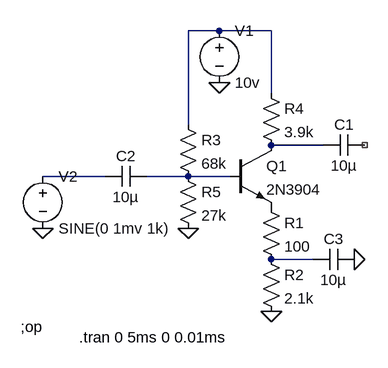
[diagram p0: schematic Az1.asc]
Az1.asc, the LTspice schematic file:
Version 4
SHEET 1 880 680
WIRE 112 -80 64 -80
WIRE 192 -80 112 -80
WIRE 192 16 192 -80
WIRE 64 64 64 -80
WIRE 272 96 192 96
WIRE -64 144 -160 144
WIRE 64 144 0 144
WIRE 128 144 64 144
WIRE 256 272 192 272
FLAG 64 224 0
FLAG 192 352 0
FLAG 112 0 0
FLAG -160 224 0
FLAG 320 272 0
SYMBOL npn 128 96 R0
SYMATTR InstName Q1
SYMATTR Value 2N3904
SYMBOL res 176 176 R0
SYMATTR InstName R1
SYMATTR Value 100
SYMBOL res 176 256 R0
SYMATTR InstName R2
SYMATTR Value 2.1k
SYMBOL res 48 48 R0
SYMATTR InstName R3
SYMATTR Value 68k
SYMBOL res 176 0 R0
SYMATTR InstName R4
SYMATTR Value 3.9k
SYMBOL res 48 128 R0
SYMATTR InstName R5
SYMATTR Value 27k
SYMBOL cap 336 80 R90
WINDOW 0 0 32 VBottom 2
WINDOW 3 32 32 VTop 2
SYMATTR InstName C1
SYMATTR Value 10µ
SYMBOL cap 0 128 R90
WINDOW 0 0 32 VBottom 2
WINDOW 3 32 32 VTop 2
SYMATTR InstName C2
SYMATTR Value 10µ
SYMBOL cap 320 256 R90
WINDOW 0 0 32 VBottom 2
WINDOW 3 32 32 VTop 2
SYMATTR InstName C3
SYMATTR Value 10µ
SYMBOL voltage 112 -96 R0
WINDOW 123 0 0 Left 0
WINDOW 39 0 0 Left 0
SYMATTR InstName V1
SYMATTR Value 10v
SYMBOL voltage -160 128 R0
WINDOW 123 0 0 Left 0
WINDOW 39 0 0 Left 0
SYMATTR InstName V2
SYMATTR Value SINE(0 1mv 1k)
TEXT -194 376 Left 2 !;op
TEXT -104 392 Left 2 !.tran 0 5ms 0 0.01ms

The netlist it stands for:
* Az1.asc
Q1 N002 N004 P001 0 2N3904
R1 P001 N005 100
R2 N005 0 2.1k
R3 N001 N004 68k
R4 N001 N002 3.9k
R5 N004 0 27k
C1 NC_01 N002 10µ
C2 N004 N003 10µ
C3 0 N005 10µ
V1 N001 0 10v
V2 N003 0 SINE(0 1mv 1k)
.model NPN NPN
.model PNP PNP
.lib standard.bjt
;op
.tran 0 5ms 0 0.01ms
.backanno
.end